# Altium schematic sheet POWER_EXTENSION.SchDoc
size A3; SheetNumber: 12; SheetTotal: 20
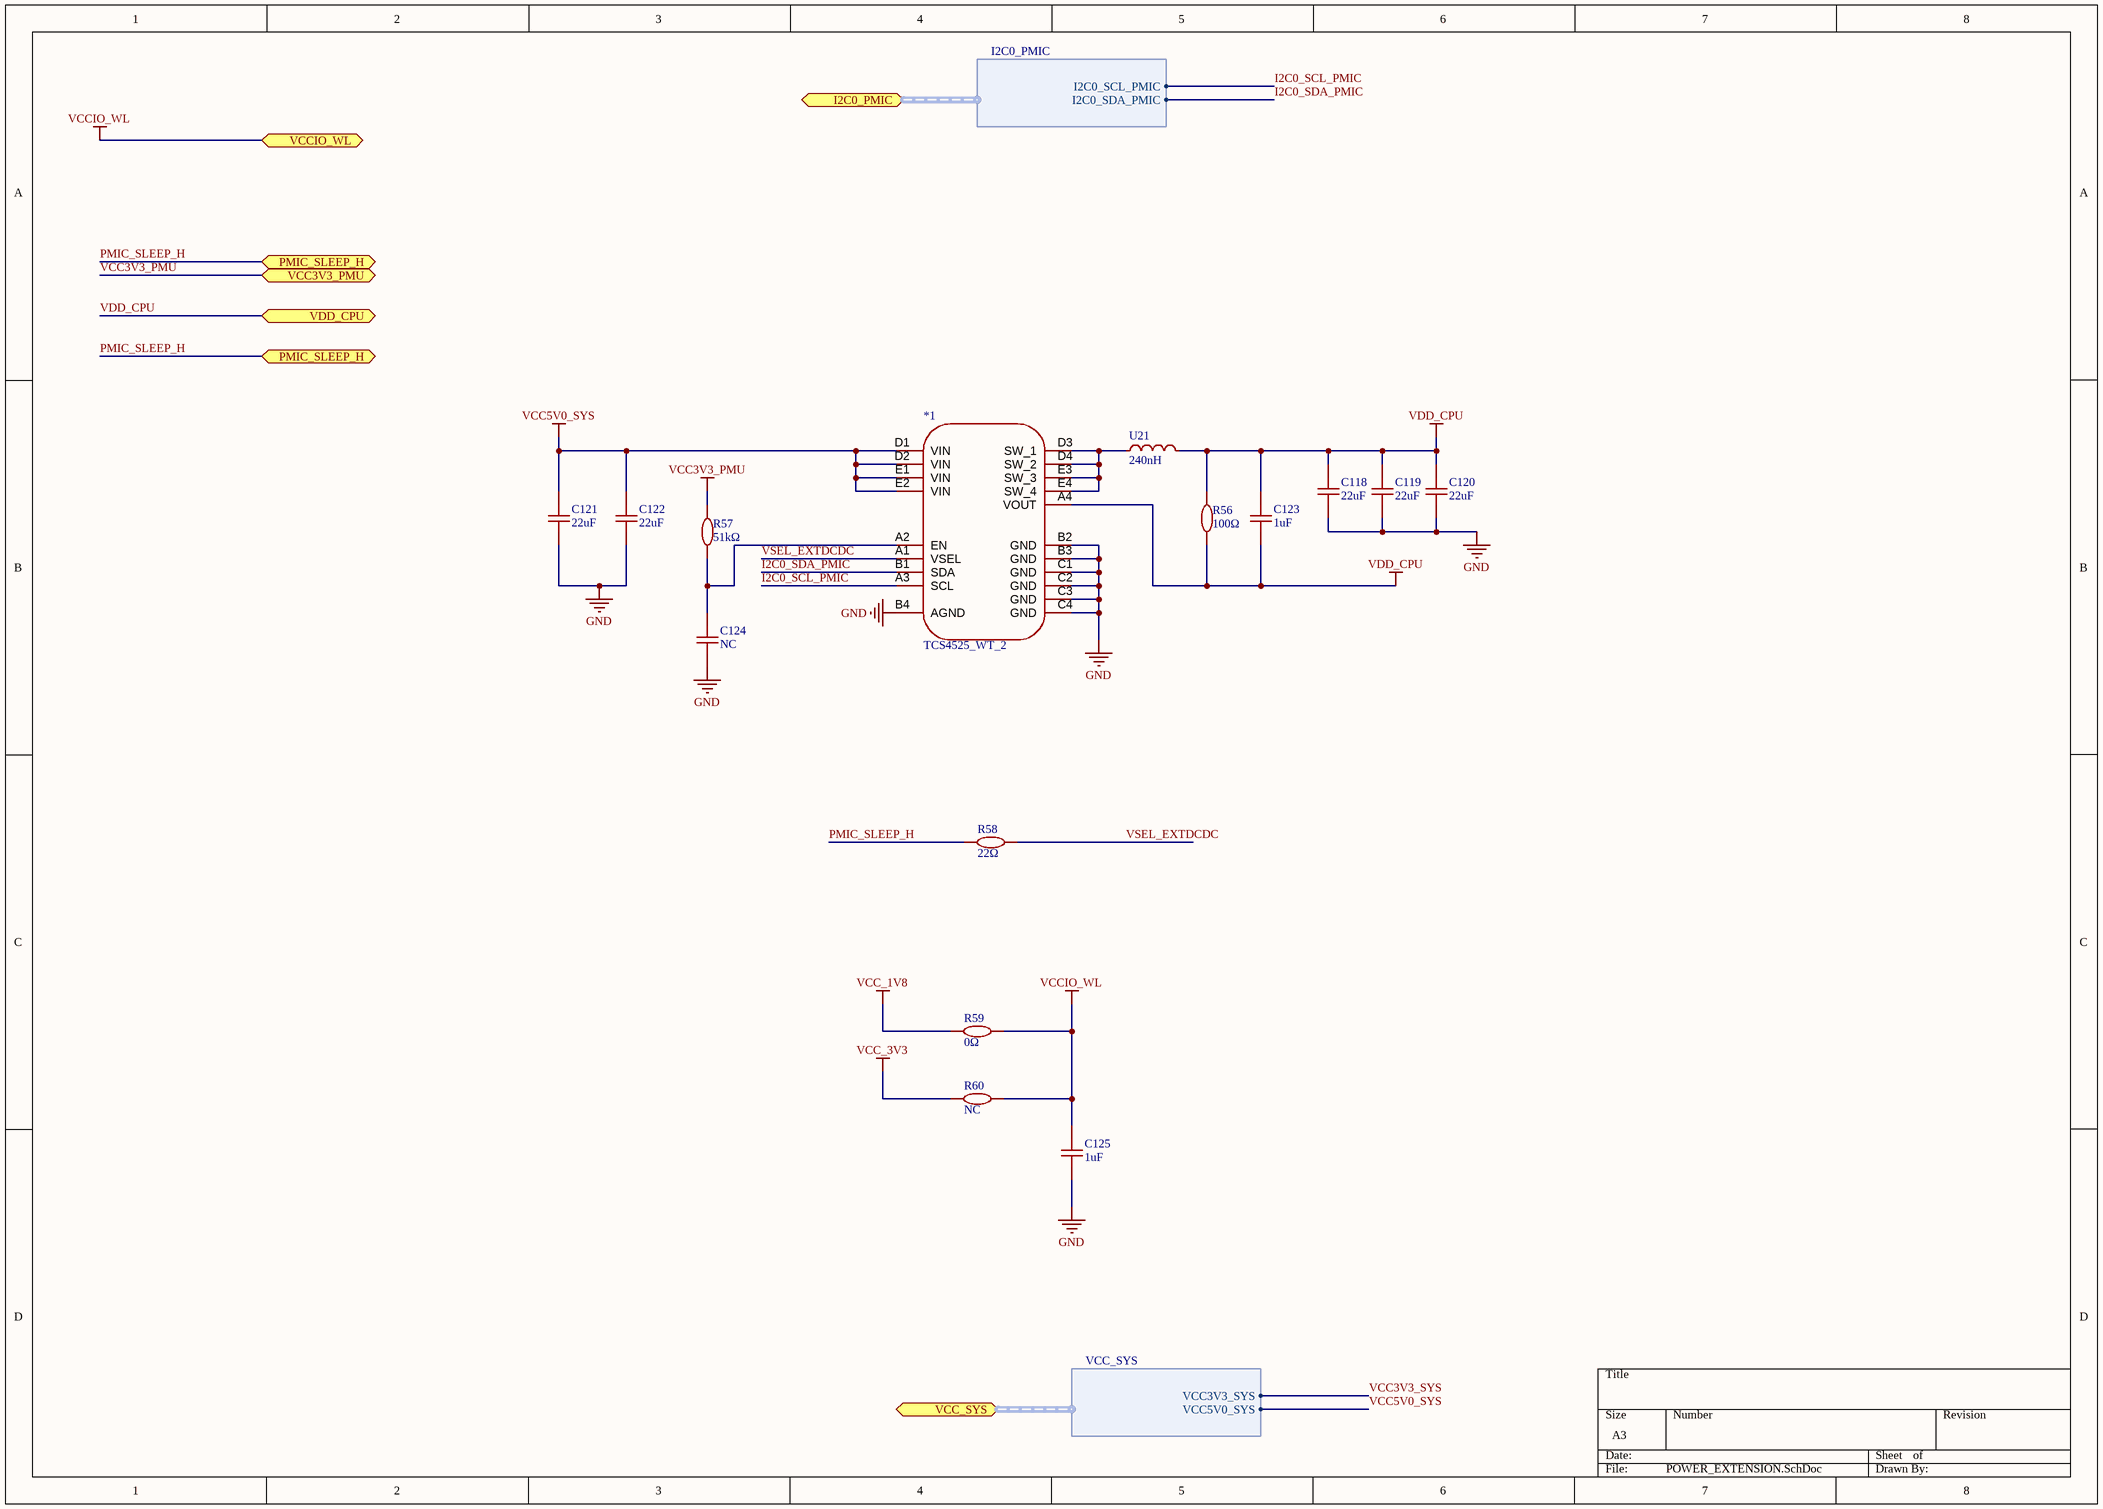
[diagram p0: POWER_EXTENSION.SchDoc]

## Parts
*1  TCS4525_WT_2  [TCS4525]
C118  22uF  [C0603]
C119  22uF  [C0603]
C120  22uF  [C0603]
C121  22uF  [C0603]
C122  22uF  [C0603]
C123  1uF  [C0402]
C124  NC  [C0402]
C125  1uF  [C0402]
R56  100Ω  [R0402]
R57  51kΩ  [R0402]
R58  22Ω  [R0402]
R59  0Ω  [R0402]
R60  NC  [R0402]
U21  240nH  [IND-SMD_L2.5-W2.0_WPN252012H]

## Ports
I2C0_PMIC (bidir, harness I2C0_PMIC, see POWER[4C], POWER[4D], POWER_PMIC[1A], RK3566[3D], RK3566_OSC_PLL_PMUO1_2[5A]), PMIC_SLEEP_H (bidir, see POWER[4C], POWER[4D], POWER_PMIC[7A], RK3566[3D], RK3566_OSC_PLL_PMUO1_2[2B]), VCC3V3_PMU (bidir, see POWER[5C], POWER_FLASH_POWER_MANAGE[3A], POWER_PMIC[7D]), VCC_SYS (bidir, harness VCC_SYS, see POWER[5C], Audio_AND_HPJ[3A], DEBUG_AND_GPIO[1D], HDMI[2C], MIPI_DSI_TP[6A], POWER[3B], POWER[6B], POWER_FLASH_POWER_MANAGE[3C], POWER_PMIC[6D], Wi-Fi_BT[3D]), VCCIO_WL (bidir, see POWER[4C], POWER[4D], POWER_PMIC[1D], POWER_PMIC[4A], RK3566[3B], RK3566_FLASH_SD_SARADC[7C]), VDD_CPU (bidir, see POWER[5D], RK3566[3D], RK3566_POWER[3A])

## Harnesses
I2C0_PMIC: I2C0_SCL_PMIC, I2C0_SDA_PMIC
VCC_SYS: VCC3V3_SYS, VCC5V0_SYS

## Nets
GND: *1.B2(GND) *1.B3(GND) *1.B4(AGND) *1.C1(GND) *1.C2(GND) *1.C3(GND) *1.C4(GND) C118.1 C119.1 C120.1 C121.1 C122.1 C124.1 C125.1
VCC3V3_PMU: R57.2 ; port VCC3V3_PMU
VCC5V0_SYS: *1.D1(VIN) *1.D2(VIN) *1.E1(VIN) *1.E2(VIN) C121.2 C122.2 ; port VCC_SYS.VCC5V0_SYS
VCC_1V8: R59.1
VCC_3V3: R60.1
VCCIO_WL: C125.2 R59.2 R60.2 ; port VCCIO_WL
VDD_CPU: *1.A4(VOUT) C118.2 C119.2 C120.2 C123.1 C123.2 R56.1 R56.2 U21.2 ; port VDD_CPU
I2C0_SCL_PMIC: *1.A3(SCL) ; port I2C0_PMIC.I2C0_SCL_PMIC
I2C0_SDA_PMIC: *1.B1(SDA) ; port I2C0_PMIC.I2C0_SDA_PMIC
PMIC_SLEEP_H: R58.1 ; port PMIC_SLEEP_H
VCC3V3_SYS: port VCC_SYS.VCC3V3_SYS
VSEL_EXTDCDC: *1.A1(VSEL) R58.2
Net*1_A2: *1.A2(EN) C124.2 R57.1
Net*1_D3: *1.D3(SW_1) *1.D4(SW_2) *1.E3(SW_3) *1.E4(SW_4) U21.1

## Library data of the parts
*1 = TCS4525_WT_2: LDO from TaoBao
C118-C122 = 22uF: 16V 22uF X5R ±20% 0603 Ceramic Capacitors ROHS
C123 C125 = 1uF: 50V 1uF X5R ±10% 0402 Ceramic Capacitors ROHS
C124 = 1nF: 50V 1nF X7R ±10% 0402 Ceramic Capacitors ROHS
R56 = 100Ω: 100Ω 62.5mW 50V ±100ppm/℃ Thick Film Resistor ±1% 0402 Chip Resistor - Surface Mount ROHS
R57 = 51kΩ: 51kΩ 62.5mW 50V ±100ppm/℃ Thick Film Resistor ±1% 0402 Chip Resistor - Surface Mount ROHS
R58 = 22Ω: 小尺寸、重量轻。降低组装成本,与贴片机匹配。适用于波峰焊和回流焊
R59 R60 = 0Ω: 0Ω 62.5mW 50V Thick Film Resistor ±1% 0402 Chip Resistor - Surface Mount ROHS
U21 = WPN252012HR24MT